# Altium project EEE3061WDesignProject_LEDLightSensorV2.0.PrjPcb
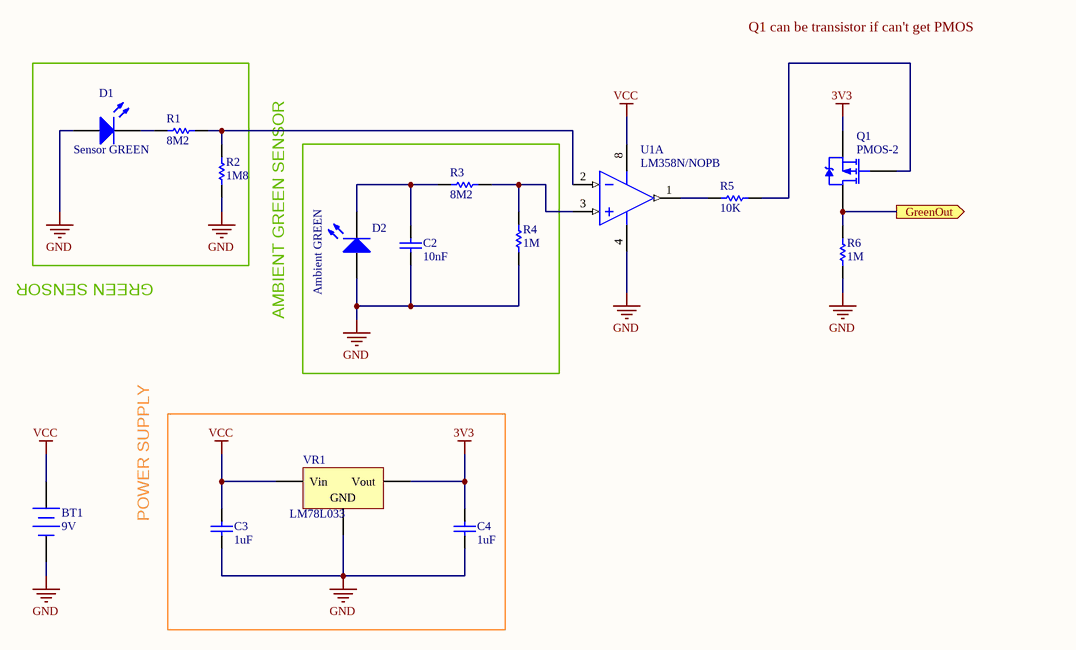
[diagram p0: LightSensorSchematic.SchDoc]
1 sheet, 15 parts. Net scope: flat (ports and power ports of the same name join across sheets).

## Sheet LightSensorSchematic.SchDoc: EEE3061WDesignProject - Active Light Sensor V2.0
size A4; Revision: 5; SheetNumber: 1; SheetTotal: 1; PageSetup: Record=PageOptions|CenterHorizontal=True|CenterVertical=True|PrintScale=1.00|XCorrection=1.00|YCorrection=1.00|PrintKind=1|BorderSize=5000000|LeftOffset=0|BottomOffset=0|Orientation=2|PaperLength=2970|PaperWidth=2100|Scale=100|PaperSource=7|PrintQuality=600|MediaType=1|DitherType=10|PrintScaleMode=1|PaperKind=A4|PaperIndex=9

### Parts
BT1  9V  [BAT-2]
C2  10nF  [RAD-0.3]
C3  1uF  [RAD-0.3]
C4  1uF  [RAD-0.3]
D1  Sensor GREEN  [LED-0]
D2  Ambient GREEN  [LED-0]
Q1  PMOS-2  [TO-220AB]
R1  8M2  [AXIAL-0.3]
R2  1M8  [AXIAL-0.3]
R3  8M2  [AXIAL-0.3]
R4  1M  [AXIAL-0.3]
R5  10K  [AXIAL-0.3]
R6  1M  [AXIAL-0.3]
U1  LM358N/NOPB  [N08E]  (part A of 2)
VR1  LM78L033  [D2PAK_N]

### Ports
GreenOut (out)

### Nets
3V3: C4.2 Q1.3(S) VR1.3(Vout)
GND: BT1.2(-) C2.1 C3.1 C4.1 D1.1(A) D2.1(A) R2.1 R4.1 R6.1 U1.4(GND) VR1.2(GND)
VCC: BT1.1(+) C3.2 U1.8(V+) VR1.1(Vin)
NetC2_2: C2.2 D2.2(K) R3.1
NetD1_2: D1.2(K) R1.1
NetQ1_1: Q1.1(G) R5.2
NetQ1_2: Q1.2(D) R6.2 ; port GreenOut
NetR1_2: R1.2 R2.2 U1.2(INA-)
NetR3_2: R3.2 R4.2 U1.3(INA+)
NetR5_1: R5.1 U1.1(OUTA)

### Notes on the sheet
- Q1 can be transistor if can't get PMOS
- GREEN SENSOR
- AMBIENT GREEN SENSOR
- POWER SUPPLY

### Library data of the parts
BT1 = Battery: Multicell Battery; Published: 24-Mar-1999; LatestRevisionDate: 17-Jul-2002; LatestRevisionNote: Re-released for DXP Platform.; PackageReference: BAT-2; Publisher: Altium Limited; PackageDescription: Battery; 2 Leads; Value: 9V
C2-C4 = Cap: Capacitor; Published: 8-Jun-2000; LatestRevisionDate: 17-Jul-2002; LatestRevisionNote: Re-released for DXP Platform.; PackageReference: RAD-0.3; Publisher: Altium Limited; PackageDescription: Radial Cap, Thru-Hole; 2 Leads; 0.3 in Pin Spacing
  C2: Value: 10nF
  C3 C4: Value: 1uF
D1 D2 = LED0: Typical INFRARED GaAs LED; Published: 8-Jun-2000; LatestRevisionDate: 08-Jul-2005; LatestRevisionNote: Mech Layer 1 removed.; PackageReference: LED-0; Publisher: Altium Limited; PackageDescription: LED; 2 Leads
Q1 = PMOS-2: P-Channel Power MOSFET; Note: Pin 4 not drawn and electrically connected to Pin 2.; Published: 8-Jun-2000; LatestRevisionDate: 17-Jul-2002; LatestRevisionNote: Re-released for DXP Platform.; DatasheetVersion: PD-9.390D; PackageVersion: Feb-1997; PackageReference: TO-220AB; Publisher: Altium Limited; PackageDescription: TO, Thru-Hole, Vertical, Heatsink Mounted; 3 In-Line Leads; Pitch 2.54 mm; ComponentLink1Description: Manufacturer Link; ComponentLink1URL: http://www.irf.com/
R1-R6 = Res1: Resistor; Published: 8-Jun-2000; LatestRevisionDate: 17-Jul-2002; LatestRevisionNote: Re-released for DXP Platform.; PackageReference: AXIAL-0.3; Publisher: Altium Limited; PackageDescription: Axial Device, Thru-Hole; 2 Leads; 0.3 in Pin Spacing
  R1 R3: Value: 8M2
  R2: Value: 1M8
  R4 R6: Value: 1M
  R5: Value: 10K
U1 = CMP-0055-00153-1: Low Power Dual Operational Amplifier, 8-pin MDIP, Pb-Free; Manufacturer: National Semiconductor; PowerWise: N; PackageTopMarking: NSUZXYTTE#*LM*358N; CompType: Amplifiers; Code_JEDEC: MS-001-BA; DatasheetVersion: Oct-2005; RoHS: Y; PackageVersion: revG, May-2006; PackageReference: N08E; PackageDescription: MDIP, .365 x .250 x .130in, 8 Lead, .100in Pitch; PinCount: 8; PartId: 1
VR1 = Volt Reg: Voltage Regulator; Published: 24-Mar-1999; LatestRevisionDate: 29-May-2009; LatestRevisionNote: IPC-7351 Footprint Added.; PackageReference: D2PAK; Publisher: Altium Limited; PackageDescription: 3-Pin Transistor Outline Package 2.54 mm Pitch, 15.1 mm Lead Span